# Altium project F030_LCD_PCB_Project.PrjPcb
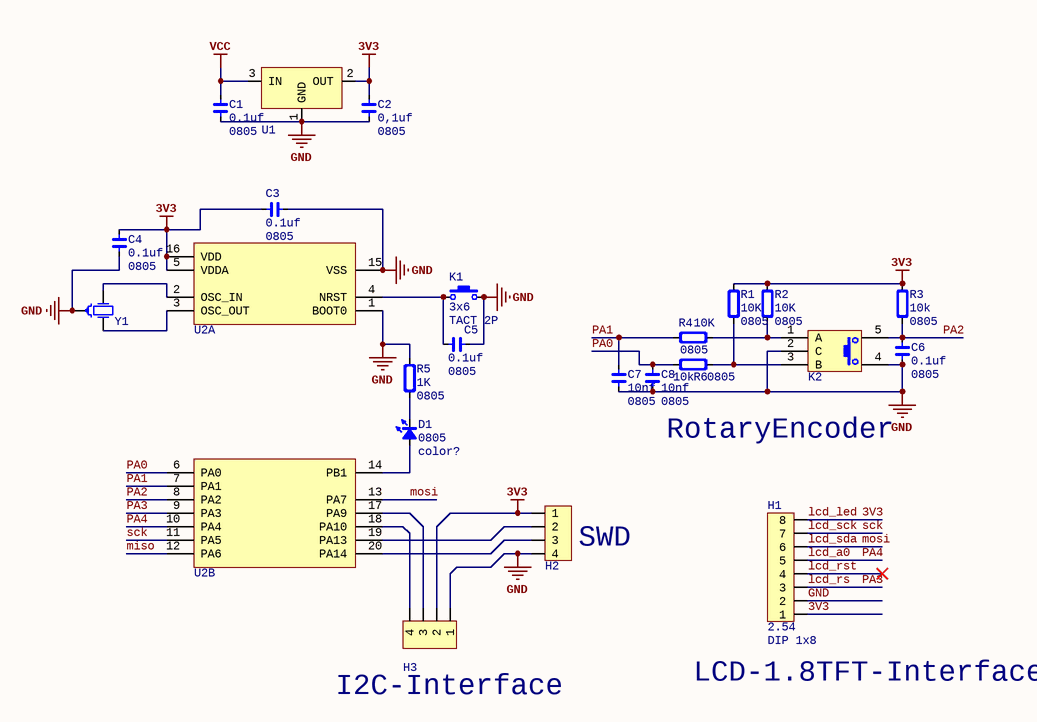
[diagram p0: Sheet1.SchDoc]
1 sheet, 23 parts. Net scope: global (net labels, ports and power ports of the same name join across sheets).
Board file: PCB1.PcbDoc

## Sheet Sheet1.SchDoc
size A4

### Parts
C1  value 0.1uf  Type: 0805  [CAP_0805]  (hidden comment: HDR2x10_2.54)
C2  value 0,1uf  Type: 0805  [CAP_0805]  (hidden comment: HDR2x10_2.54)
C3  value 0.1uf  Type: 0805  [CAP_0805]  (hidden comment: HDR2x10_2.54)
C4  value 0.1uf  Type: 0805  [CAP_0805]  (hidden comment: HDR2x10_2.54)
C5  value 0.1uf  Type: 0805  [CAP_0805]  (hidden comment: HDR2x10_2.54)
C6  value 0.1uf  Type: 0805  [CAP_0805]  (hidden comment: HDR2x10_2.54)
C7  value 10nf  Type: 0805  [CAP_0805]  (hidden comment: HDR2x10_2.54)
C8  value 10nf  Type: 0805  [CAP_0805]  (hidden comment: HDR2x10_2.54)
D1  value color?  Type: 0805  [LED_0805_RED]  (hidden comment: HDR2x10_2.54)
H1  value 2.54  Type: DIP 1x8  [HDR1X8_2.54_180]  (hidden comment: HDR2x10_2.54)
H2  HDR2x10_2.54  [HDR1x4_2.54_180]  (value not drawn)
H3  HDR2x10_2.54  [HDR1x4_2.54_180]  (value not drawn)
K1  value 3x6  type: TACT 2P  [ButtonTACT_3x6x2.5_180]  (hidden comment: HDR2x10_2.54)
K2  HDR2x10_2.54  [RotaryEncoder]  (value not drawn)
R1  value 10K  Type: 0805  [RES_0805]  (hidden comment: HDR2x10_2.54)
R2  value 10K  Type: 0805  [RES_0805]  (hidden comment: HDR2x10_2.54)
R3  value 10k  Type: 0805  [RES_0805]  (hidden comment: HDR2x10_2.54)
R4  value 10K  Type: 0805  [RES_0805]  (hidden comment: HDR2x10_2.54)
R5  value 1K  Type: 0805  [RES_0805]  (hidden comment: HDR2x10_2.54)
R6  value 10k  Type: 0805  [RES_0805]  (hidden comment: HDR2x10_2.54)
U1  HDR2x10_2.54  [SOT223-3]  (value not drawn)
U2  HDR2x10_2.54  [TSSOP_E170_P0.65_20]  (value not drawn)  (parts A,B of 2)
Y1  HDR2x10_2.54  [XTAL_3P_CSTCE_8M_3.2*1.3]  (value not drawn)

### Nets
3V3: C2.2 C3.2 C4.1 H1.1 H1.8 H2.1 H3.2 R1.2 R2.2 R3.1 U1.2(OUT) U2.5(VDDA) U2.16(VDD)  [also labelled lcd_led]
GND: C1.1 C2.1 C3.1 C4.2 C5.1 C6.1 C7.1 C8.1 H1.2 H2.4 H3.1 K1.2 K2.2(C) K2.4 R5.2 U1.1(GND) U2.1(BOOT0) U2.15(VSS) Y1.2(GND)
VCC: C1.2 U1.3(IN)
lcd_a0: H1.5 U2.10(PA4)  [also labelled PA4]
lcd_rs: H1.3 U2.9(PA3)  [also labelled PA3]
lcd_rst: H1.4
lcd_sck: H1.7 U2.11(PA5)  [also labelled sck]
lcd_sda: H1.6 U2.13(PA7)  [also labelled mosi]
miso: U2.12(PA6)
PA0: C8.2 R6.1 U2.6(PA0)
PA1: C7.2 R4.1 U2.7(PA1)
PA2: C6.2 K2.5 R3.2 U2.8(PA2)
NetC5_2: C5.2 K1.1 U2.4(NRST)
NetD1_1: D1.1(A) U2.14(PB1)
NetD1_2: D1.2(K) R5.1
NetH2_2: H2.2 U2.19(PA13)
NetH2_3: H2.3 U2.20(PA14)
NetH3_3: H3.3 U2.17(PA9)
NetH3_4: H3.4 U2.18(PA10)
NetK2_1: K2.1(A) R2.1 R4.2
NetK2_3: K2.3(B) R1.1 R6.2
NetU2_2: U2.2(OSC_IN) Y1.1(OSC1)
NetU2_3: U2.3(OSC_OUT) Y1.3(OSC2)

### Notes on the sheet
- RotaryEncoder
- (near H2) SWD
- (near H1) LCD-1.8TFT-Interface
- (near H3) I2C-Interface

### Library data of the parts
C1-C8 = Cap_0805: Capacitor; Specification: X7R 50V; Manufacturer: *
D1 = LED_0805: LED
H1 = HDR1x8_2.54: Header
H2 H3 = HDR1x4_2.54: Header
K1 = ButtonTACT_3x6x2.5_180: Button
K2 = RotaryEncoder: Encoder; Value: RotaryEncoder
R1-R6 = Res_0805: Resistor; Specification: ±5%; Manufacturer: *
U1 = TLV1117: Power
U2 = STM32F03xF: MCU
Y1 = XTAL-3PIN: murata CSTCE 8M 3.2*1.3